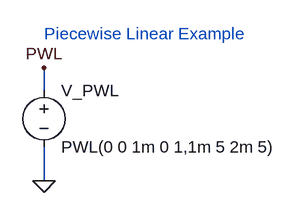
[diagram p0: schematic Draft4.asc]
Draft4.asc, the LTspice schematic file:
Version 4
SHEET 1 880 680
WIRE 64 96 64 64
WIRE 64 224 64 176
FLAG 64 224 0
FLAG 64 64 PWL
SYMBOL voltage 64 80 R0
WINDOW 123 0 0 Left 0
WINDOW 39 0 0 Left 0
SYMATTR InstName V_PWL
SYMATTR Value PWL(0 0 1m 0 1,1m 5 2m 5)
TEXT 64 16 Left 2 ;Piecewise Linear Example

The netlist it stands for:
* Draft4.asc
V_PWL PWL 0 PWL(0 0 1m 0 1,1m 5 2m 5)
* Piecewise Linear Example
.backanno
.end